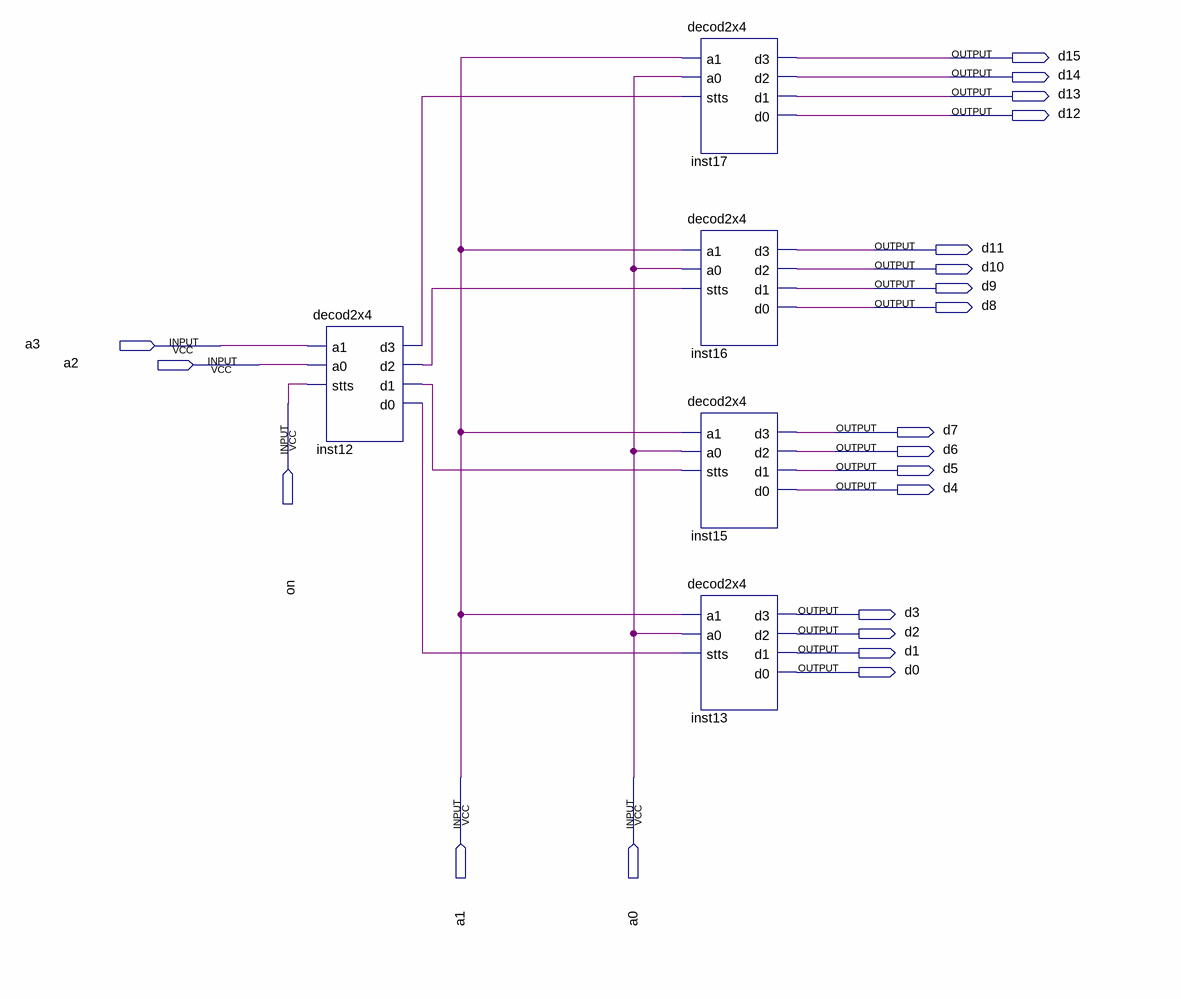
[diagram p0: schematic sheet]
// Quartus schematic decod4x16.bdf as structural Verilog: 5 symbols, 21 pins
module decod4x16 (
  input  a3,
  input  a2,
  input  on,
  input  a1,
  input  a0,
  output d15,
  output d14,
  output d13,
  output d12,
  output d11,
  output d10,
  output d9,
  output d8,
  output d7,
  output d6,
  output d5,
  output d4,
  output d3,
  output d2,
  output d1,
  output d0
);

  wire inst12_d0, inst12_d1, inst12_d2, inst12_d3;

  decod2x4 inst12 (.a1(a3), .a0(a2), .stts(on), .d3(inst12_d3), .d2(inst12_d2), .d1(inst12_d1), .d0(inst12_d0));
  decod2x4 inst17 (.a1(a1), .a0(a0), .stts(inst12_d3), .d3(d15), .d2(d14), .d1(d13), .d0(d12));
  decod2x4 inst16 (.a1(a1), .a0(a0), .stts(inst12_d2), .d3(d11), .d2(d10), .d1(d9), .d0(d8));
  decod2x4 inst15 (.a1(a1), .a0(a0), .stts(inst12_d1), .d3(d7), .d2(d6), .d1(d5), .d0(d4));
  decod2x4 inst13 (.a1(a1), .a0(a0), .stts(inst12_d0), .d3(d3), .d2(d2), .d1(d1), .d0(d0));
endmodule
